# Altium schematic sheet Interfaces.SchDoc
size A3; DocumentNumber: 8; SheetNumber: 8; SheetTotal: 9; PageSetup: Record=PageOptions|CenterHorizontal=True|CenterVertical=True|PrintScale=0.97|XCorrection=1.00|YCorrection=1.00|PrintKind=1|BorderSize=5000000|LeftOffset=0|BottomOffset=0|Orientation=2|PaperLength=2970|PaperWidth=2100|Scale=100|PaperSource=7|PrintQuality=600|MediaType=1|DitherType=10|PaperKind=A4|PrintScaleMode=1
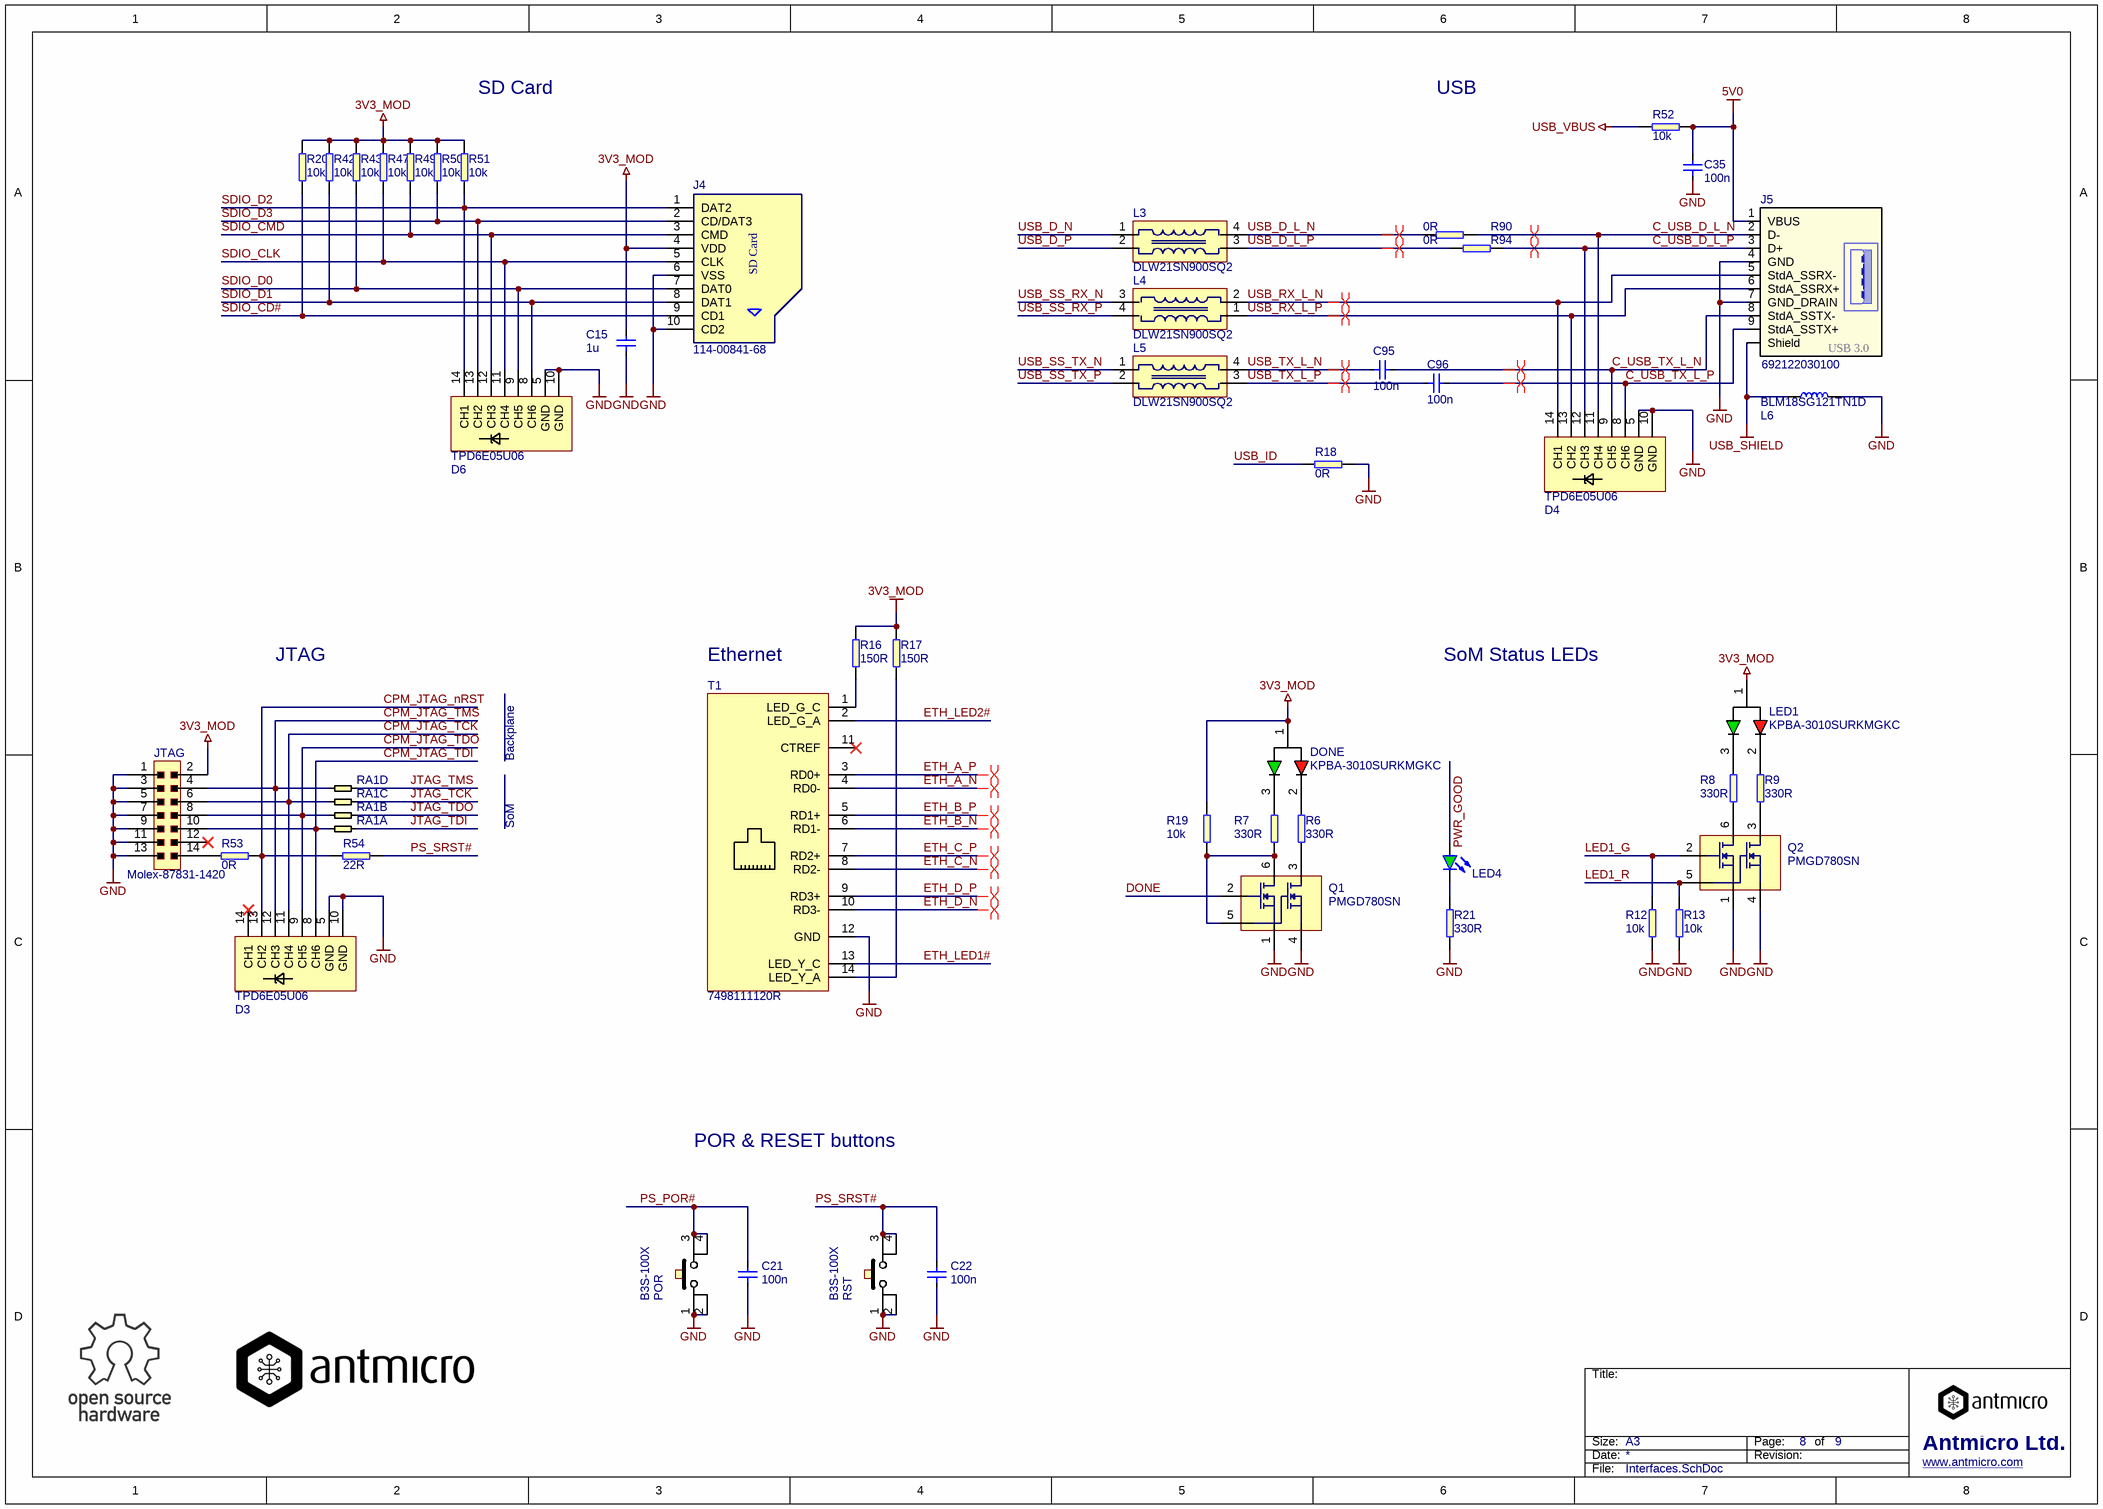
[diagram p0: Interfaces.SchDoc]

## Parts
C15  1u  [0603]
C21  100n  [0603]
C22  100n  [0603]
C35  100n  [0402]
C95  100n  [0402]
C96  100n  [0402]
D3  TPD6E05U06  [TPD6E05U06_PASS]
D4  TPD6E05U06  [TPD6E05U06_PASS]
D6  TPD6E05U06  [TPD6E05U06_PASS]
DONE  KPBA-3010SURKMGKC  [3010SURKMGKC]
J4  114-00841-68  [114-00841-68]
J5  692122030100  [WE_692122030100]
JTAG  Molex-87831-1420  [CON-Molex-87831-1420]
L3  DLW21SN900SQ2  [DLW21SN900SQ2]
L4  DLW21SN900SQ2  [DLW21SN900SQ2]
L5  DLW21SN900SQ2  [DLW21SN900SQ2]
L6  BLM18SG121TN1D  [0603]
LED1  KPBA-3010SURKMGKC  [3010SURKMGKC]
LED4  KPT-1608SGC  [LED0603]  (value not drawn)
POR  B3S-100X  [B3S-100X]
Q1  PMGD780SN  [SOT-363]
Q2  PMGD780SN  [SOT-363]
R6  330R  [0603]
R7  330R  [0603]
R8  330R  [0402]
R9  330R  [0402]
R12  10k  [0402]
R13  10k  [0402]
R16  150R  [0603]
R17  150R  [0603]
R18  0R  [0603]
R19  10k  [0603]
R20  10k  [0402]
R21  330R  [0603]
R42  10k  [0402]
R43  10k  [0402]
R47  10k  [0402]
R49  10k  [0402]
R50  10k  [0402]
R51  10k  [0402]
R52  10k  [0603]
R53  0R  [0603]
R54  22R  [0603]
R90  0R  [0402]
R94  0R  [0402]
RA1  22R  [RA_1206]  (value not drawn)  (parts A,B,C,D of 4)
RST  B3S-100X  [B3S-100X]
T1  7498111120R  [7498111120R]

## Nets
3V3_MOD: C15.2 DONE.1(CA) J4.4(VDD) JTAG.2 LED1.1(CA) R16.2 R17.2 R19.2 R20.2 R42.2 R43.2 R47.2 R49.2 R50.2 R51.2
5V0: C35.2 J5.1(VBUS) R52.2
GND: C15.1 C21.1 C22.1 C35.1 D3.5(GND) D3.10(GND) D4.5(GND) D4.10(GND) D6.5(GND) D6.10(GND) J4.6(VSS) J4.10(CD2) J5.4(GND) J5.7(GND_DRAIN) JTAG.1 JTAG.3 JTAG.5 JTAG.7 JTAG.9 JTAG.11 JTAG.13 L6.2 POR.1 POR.2 Q1.1(S1) Q1.4(S2) Q2.1(S1) Q2.4(S2) R12.1 R13.1 R18.2 R21.2 RST.1 RST.2 T1.12(GND)
USB_SHIELD: J5.Z1(Shield) L6.1
USB_VBUS: R52.1
C_USB_D_L_N: D4.11(CH4) J5.2(D-) R90.2
C_USB_D_L_P: D4.12(CH3) J5.3(D+) R94.2
C_USB_TX_L_N: C95.2 D4.9(CH5) J5.8(StdA_SSTX-)
C_USB_TX_L_P: C96.2 D4.8(CH6) J5.9(StdA_SSTX+)
CPM_JTAG_nRST: D3.13(CH2) R53.2 R54.1
CPM_JTAG_TCK: D3.11(CH4) JTAG.6 RA1.3
CPM_JTAG_TDI: D3.8(CH6) JTAG.10 RA1.1
CPM_JTAG_TDO: D3.9(CH5) JTAG.8 RA1.2
CPM_JTAG_TMS: D3.12(CH3) JTAG.4 RA1.4
DONE: Q1.2(G1)
ETH_A_N: T1.4(RD0-)
ETH_A_P: T1.3(RD0+)
ETH_B_N: T1.6(RD1-)
ETH_B_P: T1.5(RD1+)
ETH_C_N: T1.8(RD2-)
ETH_C_P: T1.7(RD2+)
ETH_D_N: T1.10(RD3-)
ETH_D_P: T1.9(RD3+)
ETH_LED1#: T1.13(LED_Y_C)
ETH_LED2#: T1.2(LED_G_A)
JTAG_TCK: RA1.7
JTAG_TDI: RA1.5
JTAG_TDO: RA1.6
JTAG_TMS: RA1.8
LED1_G: Q2.2(G1) R12.2
LED1_R: Q2.5(G2) R13.2
PS_POR#: C21.2 POR.3 POR.4
PS_SRST#: C22.2 R54.2 RST.3 RST.4
PWR_GOOD: LED4.A
SDIO_CD#: J4.9(CD1) R20.1
SDIO_CLK: D6.11(CH4) J4.5(CLK) R47.1
SDIO_CMD: D6.12(CH3) J4.3(CMD) R49.1
SDIO_D0: D6.9(CH5) J4.7(DAT0) R43.1
SDIO_D1: D6.8(CH6) J4.8(DAT1) R42.1
SDIO_D2: D6.14(CH1) J4.1(DAT2) R51.1
SDIO_D3: D6.13(CH2) J4.2(CD/DAT3) R50.1
USB_D_L_N: L3.4 R90.1
USB_D_L_P: L3.3 R94.1
USB_D_N: L3.1
USB_D_P: L3.2
USB_ID: R18.1
USB_RX_L_N: D4.14(CH1) J5.5(StdA_SSRX-) L4.2
USB_RX_L_P: D4.13(CH2) J5.6(StdA_SSRX+) L4.1
USB_SS_RX_N: L4.3
USB_SS_RX_P: L4.4
USB_SS_TX_N: L5.1
USB_SS_TX_P: L5.2
USB_TX_L_N: C95.1 L5.4
USB_TX_L_P: C96.1 L5.3
NetDONE_2: DONE.2(R_K) R6.1
NetDONE_3: DONE.3(G_K) R7.1
NetJTAG_14: JTAG.14 R53.1
NetLED1_2: LED1.2(R_K) R9.2
NetLED1_3: LED1.3(G_K) R8.2
NetLED4_K: LED4.K R21.1
NetQ1_3: Q1.3(D2) R6.2
NetQ1_5: Q1.5(G2) Q1.6(D1) R7.2 R19.1
NetQ2_3: Q2.3(D2) R9.1
NetQ2_6: Q2.6(D1) R8.1
NetR16_1: R16.1 T1.1(LED_G_C)
NetR17_1: R17.1 T1.14(LED_Y_A)

Not connected (* = marked no-connect by the designer): D3 14(CH1)*; JTAG 12*; T1 11(CTREF)*

## Layout directives
differential pair: C_USB_D_L_N, C_USB_D_L_P, C_USB_TX_L_N, C_USB_TX_L_P, ETH_A_N, ETH_A_P, ETH_B_N, ETH_B_P, ETH_C_N, ETH_C_P, ETH_D_N, ETH_D_P, USB_D_L_N, USB_D_L_P, USB_RX_L_N, USB_RX_L_P, USB_TX_L_N, USB_TX_L_P

## Notes on the sheet
- SD Card
- USB
- JTAG
- Ethernet
- SoM Status LEDs
- Backplane
- SoM
- POR & RESET buttons
- Title:
- Size:
- Date:
- A3
- Revision:
- Page:
- of
- Antmicro Ltd.
- File:
- www.antmicro.com
- (in symbol AMP-114-00841-68) SD Card
- (in symbol WE_692122030100) USB 3.0

## Library data of the parts
C15 = C_1u_0603: MLCC SMT Capacitor 1uF 0603; Manufacturer: MULTICOMP; MPN: MC0603X105M6R3CT; Value: 1u; Part Number: C_1u_0603
C21 C22 = C_100n_0603: MLCC SMT Capacitor 100nF 0603; Manufacturer: WALSIN; MPN: 0603B104K500CT; Value: 100n; Part Number: C_100n_0603
C35 C95 C96 = C_100n_0402: MLCC SMT Capacitor 100nF 0402; Manufacturer: MULTICOMP; MPN: MC0402X104M100CT; Part Number: C_100n_0402; Value: 100n
D3 D4 D6 = TPD6E05U06_PASS: ESD Suppressors 6-CH Pass through layout; Manufacturer: Texas Instruments; MPN: TPD6E05U06RVZR; Part Number: TPD6E05U06_PASS; Value: TPD6E05U06
DONE LED1 = KPBA-3010SURKMGKC: LED SMD 1104 red/green 3x1mm 140° Lens: transparent; Manufacturer: Kingbright; Part Number: KPBA-3010SURKMGKC; Value: KPBA-3010SURKMGKC; MPN: KPBA-3010SURKMGKC
J4 = AMP-114-00841-68: Micro SD card holder; Manufacturer: AMPHENOL COMMERCIAL PRODUCTS; Part Number: AMP-114-00841-68; Value: 114-00841-68; MPN: 114-00841-68
J5 = WE_692122030100: Manufacturer: WURTH ELEKTRONIK; Part Number: WE_692122030100; Value: 692122030100; MPN: 692122030100
JTAG = CON-Molex-87831-1420: HEADER, SQUARE PIN, M/GRID, 14WAY; Manufacturer: MOLEX; Part Number: CON-Molex-87831-1420; Value: Molex-87831-1420; MPN: 87831-1420
L3-L5 = DLW21SN900SQ2: Common mode choke; Manufacturer: MURATA; MPN: DLW21SN900SQ2L; Part Number: DLW21SN900SQ2; Value: DLW21SN900SQ2
L6 = BLM18SG121TN1D: FERRITE BEAD, 0.025OHM, 3A, 0603; Manufacturer: MURATA; Part Number: BLM18SG121TN1D; Value: BLM18SG121TN1D; MPN: BLM18SG121TN1D
LED4 = LED_G: LED Green 0603 case; Part Number: LED_G; Manufacturer: KINGBRIGHT; Value: KPT-1608SGC; MPN: KPT-1608SGC
POR RST = B3S-100X: Manufacturer: OMRON; MPN: B3S-1002; Part Number: B3S-100X; Value: B3S-100X
Q1 Q2 = PMGD780SN: 60 V, dual N-channel Trench MOSFET; Manufacturer: NXP; MPN: PMGD780SN,115; Part Number: PMGD780SN; Value: PMGD780SN
R6 R7 R21 = R_330R_0603: SMT Resistor 330R 0603; Manufacturer: BOURNS; MPN: CR0603-FX-3300GLF; Value: 330R; Part Number: R_330R_0603
R8 R9 = R_330R_0402: SMT Resistor 0402; Manufacturer: MULTICOMP; MPN: MCMR04X3300FTL; Value: 330R; Part Number: R_330R_0402
R12 R13 R20 R42 R43 R47 R49-R51 = R_10k_0402: SMT Resistor 0402; Manufacturer: MULTICOMP; MPN: MCMR04X1002FTL; Value: 10k; Part Number: R_10k_0402
R16 R17 = R_150R_0603: SMT Resistor 150R 0603; Manufacturer: MULTICOMP; MPN: MC0063W06031150R; Value: 150R; Part Number: R_150R_0603
R18 R53 = R_0R_0603: SMT Resistor 0R 0603; Manufacturer: BOURNS; MPN: CR0603-J/-000ELF; Value: 0R; Part Number: R_0R_0603
R19 R52 = R_10k_0603: SMT Resistor 10k 0603; Manufacturer: BOURNS; MPN: CR0603-JW-103ELF; Value: 10k; Part Number: R_10k_0603
R54 = R_22R_0603: SMT Resistor 22R 0603; Manufacturer: BOURNS; MPN: CR0603-JW-220GLF; Value: 22R; Part Number: R_22R_0603
R90 R94 = R_0R_0402: SMT Resistor 0402; Manufacturer: MULTICOMP; MPN: MCMR04X000 PTL; Part Number: R_0R_0402; Value: 0R
RA1 = RA-22R-63mW-5%-1206: YAGEO (PHYCOMP)  TC164-JR-0722RL  RESISTOR ARRAY, ARC241 1206 22R; Part Number: RA-22R-63mW-5%-1206; Value: 22R; Manufacturer: YAGEO (PHYCOMP); MPN: TC164-JR-0722RL
T1 = WE_7498111120R: LAN transformer 1000Base-T; Manufacturer: WURTH ELEKTRONIK; Part Number: WE_7498111120R; Value: 7498111120R; MPN: 7498111120R